# Altium schematic sheet usbc.SchDoc: Test
size A4; DrawnBy: Łukasz Przeniosło; Organization: Apptimia sp. z o.o.; Address1: Wojska Polskiego 184c/4; Address2: 71-256 Szczecin; Address3: www.apptimia.com; DocumentNumber: 4; Revision: 1; SheetNumber: 4; SheetTotal: 12
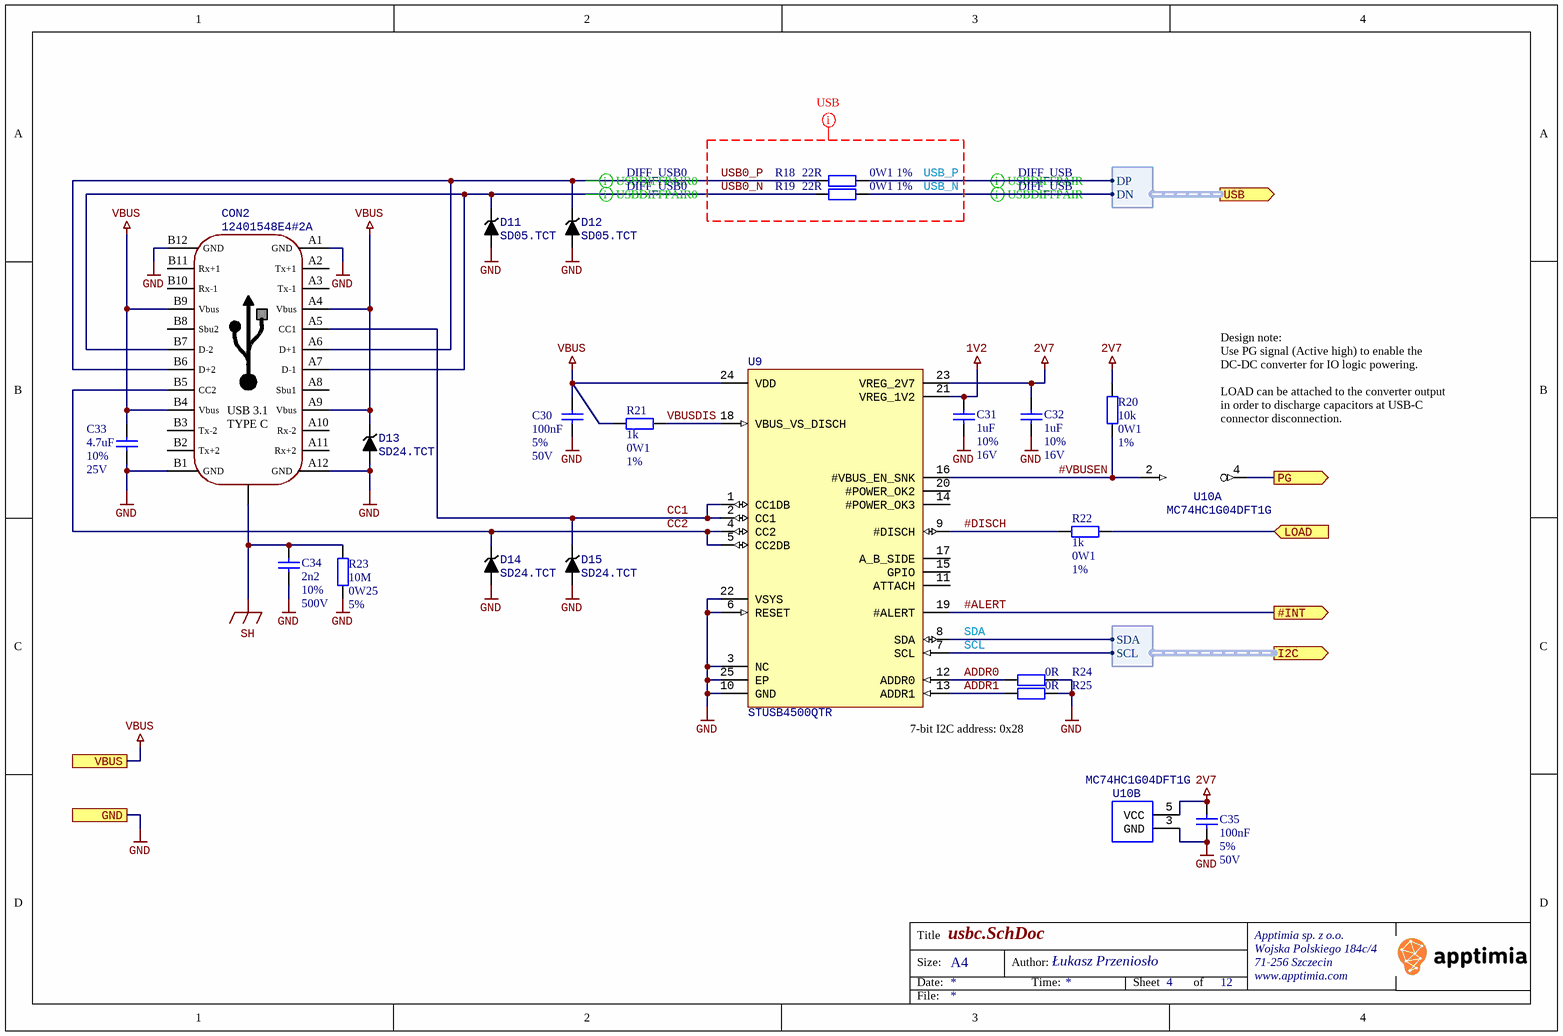
[diagram p0: usbc.SchDoc]

## Parts
C30  100nF  Tolerance: 5%  Voltage: 50V  [CAPC1608N]
C31  1uF  Tolerance: 10%  Voltage: 16V  [CAPC1608N]
C32  1uF  Tolerance: 10%  Voltage: 16V  [CAPC1608N]
C33  4.7uF  Tolerance: 10%  Voltage: 25V  [CAPC2012N]
C34  2n2  Tolerance: 10%  Voltage: 500V  [CAPC3216N]
C35  100nF  Tolerance: 5%  Voltage: 50V  [CAPC1608N]
CON2  12401548E4#2A  [12401548E4#2A]
D11  SD05.TCT  [SOD323]
D12  SD05.TCT  [SOD323]
D13  SD24.TCT  [SOD323]
D14  SD24.TCT  [SOD323]
D15  SD24.TCT  [SOD323]
R18  22R  Power: 0W1  Tolerance: 1%  [RESC1608N]
R19  22R  Power: 0W1  Tolerance: 1%  [RESC1608N]
R20  10k  Power: 0W1  Tolerance: 1%  [RESC1608N]
R21  1k  Power: 0W1  Tolerance: 1%  [RESC1608N]
R22  1k  Power: 0W1  Tolerance: 1%  [RESC1608N]
R23  10M  Power: 0W25  Tolerance: 5%  [RESC3216N]
R24  0R  [RESC1005N]
R25  0R  [RESC1005N]
U9  STUSB4500QTR  [QFN24-4mmx4mm]
U10  MC74HC1G04DFT1G  [sc70]  (parts A,B of 2)

## Ports
#INT (out), GND, I2C (out, harness I2C), LOAD (in), PG (out), USB (out, harness USB), VBUS

## Harnesses
USB: DN, DP
I2C: SCL, SDA

## Nets
1V2: C31.2 U9.21(VREG_1V2)
2V7: C32.2 C35.1 R20.2 U9.23(VREG_2V7) U10.5(VCC)
GND: C30.2 C31.1 C32.1 C33.1 C34.1 C35.2 CON2.A1(GND) CON2.A12(GND) CON2.B1(GND) CON2.B12(GND) D11.1 D12.1 D13.1 D14.1 D15.1 R23.1 R24.1 R25.1 U9.3(NC) U9.6(RESET) U9.10(GND) U9.22(VSYS) U9.25(EP) U10.3(GND) ; port GND
SH: C34.2 CON2.SH R23.2
VBUS: C30.1 C33.2 CON2.A4(Vbus) CON2.A9(Vbus) CON2.B4(Vbus) CON2.B9(Vbus) D13.2 R21.1 U9.24(VDD) ; port VBUS
#ALERT: U9.19(#ALERT) ; port #INT
#DISCH: R22.1 U9.9(#DISCH)
#VBUSEN: R20.1 U9.16(#VBUS_EN_SNK) U10.2(A)
ADDR0: R24.2 U9.12(ADDR0)
ADDR1: R25.2 U9.13(ADDR1)
CC1: CON2.A5(CC1) D15.2 U9.1(CC1DB) U9.2(CC1)
CC2: CON2.B5(CC2) D14.2 U9.4(CC2) U9.5(CC2DB)
LOAD: R22.2 ; port LOAD
PG: U10.4(Y) ; port PG
SCL: U9.7(SCL) ; port I2C.SCL
SDA: U9.8(SDA) ; port I2C.SDA
USB0_N: CON2.A7(D-1) CON2.B7(D-2) D11.2 R19.2
USB0_P: CON2.A6(D+1) CON2.B6(D+2) D12.2 R18.2
USB_N: R19.1 ; port USB.DN
USB_P: R18.1 ; port USB.DP
VBUSDIS: R21.2 U9.18(VBUS_VS_DISCH)

Not connected (* = marked no-connect by the designer): CON2 A2(Tx+1) A3(Tx-1) A8(Sbu1) A10(Rx-2) A11(Rx+2) B2(Tx+2) B3(Tx-2) B8(Sbu2) B10(Rx-1) B11(Rx+1); U9 11(ATTACH) 14(#POWER_OK3) 15(GPIO) 17(A_B_SIDE) 20(#POWER_OK2); U10 1(NC)

## Layout directives
rule Matched Net Lengths [Tolerance = 2mm]; rule Impedance Constraint [Min = 85.00    Max = 95.00    ]; net class USB_RULE: USB0_N, USB0_P, USB_N, USB_P
differential pair; net class DIFF_USB: USB_N, USB_P
differential pair; net class DIFF_USB0: USB0_N, USB0_P

## Notes on the sheet
- Design note:
  Use PG signal (Active high) to enable the DC-DC converter for IO logic powering.
  LOAD can be attached to the converter output in order to discharge capacitors at USB-C connector disconnection.
- 7-bit I2C address: 0x28
- Title
- Size:
- Date:
- A4
- Author:
- Time:
- Sheet
- of
- File:
- (in symbol 12401548E4#2A) USB 3.1; TYPE C

## Library data of the parts
C30-C35 = Capacitor
  C30 C35: Value: 100nF
  C31 C32: Value: 1uF
  C33: Value: 4.7uF
  C34: Value: 2n2
CON2 = 12401548E4#2A: Gniazdo; USB C; SMT, THT; kątowe 90°, poziome; V: USB 3.1; złocony; manid: 12401548E4#2A
D11-D15 = ESD_PROT_UNI
  D11 D12: manid: SD05.TCT
  D13-D15: manid: SD24.TCT
R18-R23 = Resistor
  R18 R19: Value: 22R
  R20: Value: 10k
  R21 R22: Value: 1k
  R23: Value: 10M
R24 R25 = Resistor: Power: 0W1; Tolerance: 5%; Value: 0R
U9 = STUSB4500: Standalone USB PD sink controller with short-to-VBUS protections; manid: STUSB4500QTR
U10 = NC7SP04: tiny logic inverter; manid: MC74HC1G04DFT1G